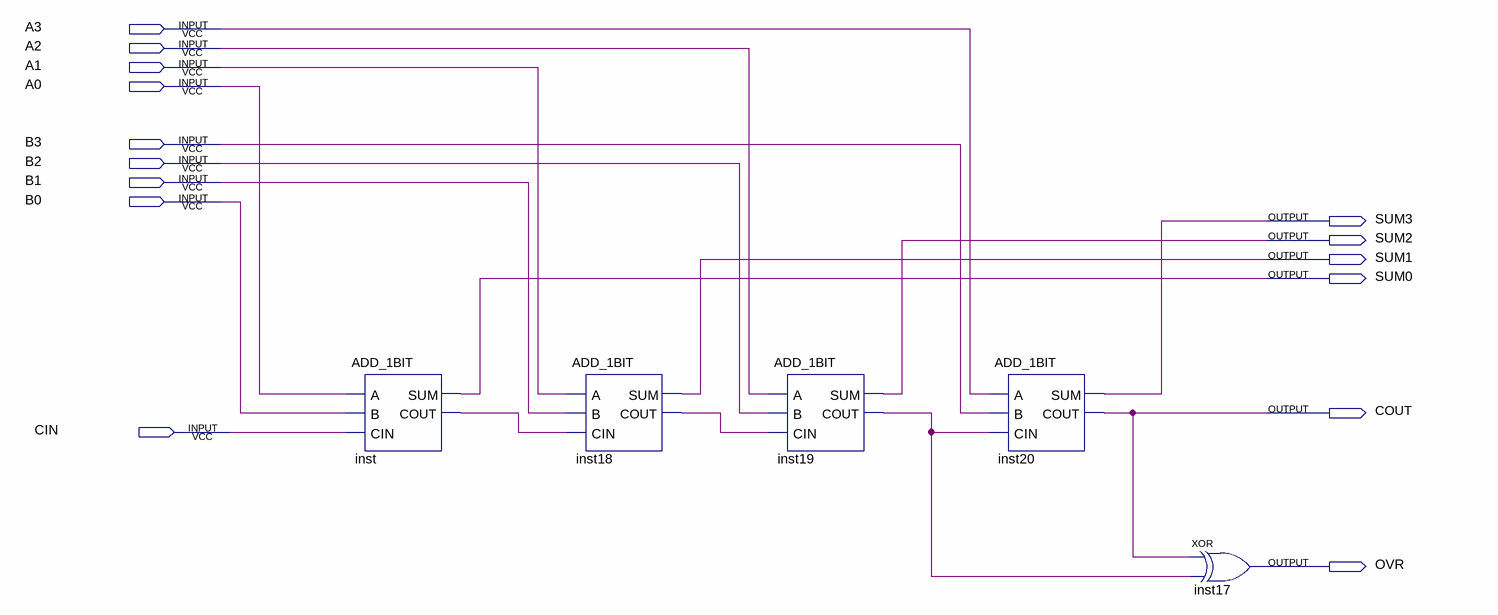
[diagram p0: schematic sheet]
// Quartus schematic ADD_4BIT.bdf as structural Verilog: 5 symbols, 15 pins
module ADD_4BIT (
  input  A3,
  input  A2,
  input  A1,
  input  A0,
  input  B3,
  input  B2,
  input  B1,
  input  B0,
  input  CIN,
  output SUM3,
  output SUM2,
  output SUM1,
  output SUM0,
  output COUT,
  output OVR
);

  wire inst18_cout, inst19_cout, inst_cout;

  ADD_1BIT inst (.A(A0), .B(B0), .CIN(CIN), .SUM(SUM0), .COUT(inst_cout));
  ADD_1BIT inst18 (.A(A1), .B(B1), .CIN(inst_cout), .SUM(SUM1), .COUT(inst18_cout));
  ADD_1BIT inst19 (.A(A2), .B(B2), .CIN(inst18_cout), .SUM(SUM2), .COUT(inst19_cout));
  ADD_1BIT inst20 (.A(A3), .B(B3), .CIN(inst19_cout), .SUM(SUM3), .COUT(COUT));
  xor inst17 (OVR, COUT, inst19_cout);
endmodule
